# Altium schematic sheet Sheet_Pedal.schdoc
size 434 x 399 mm
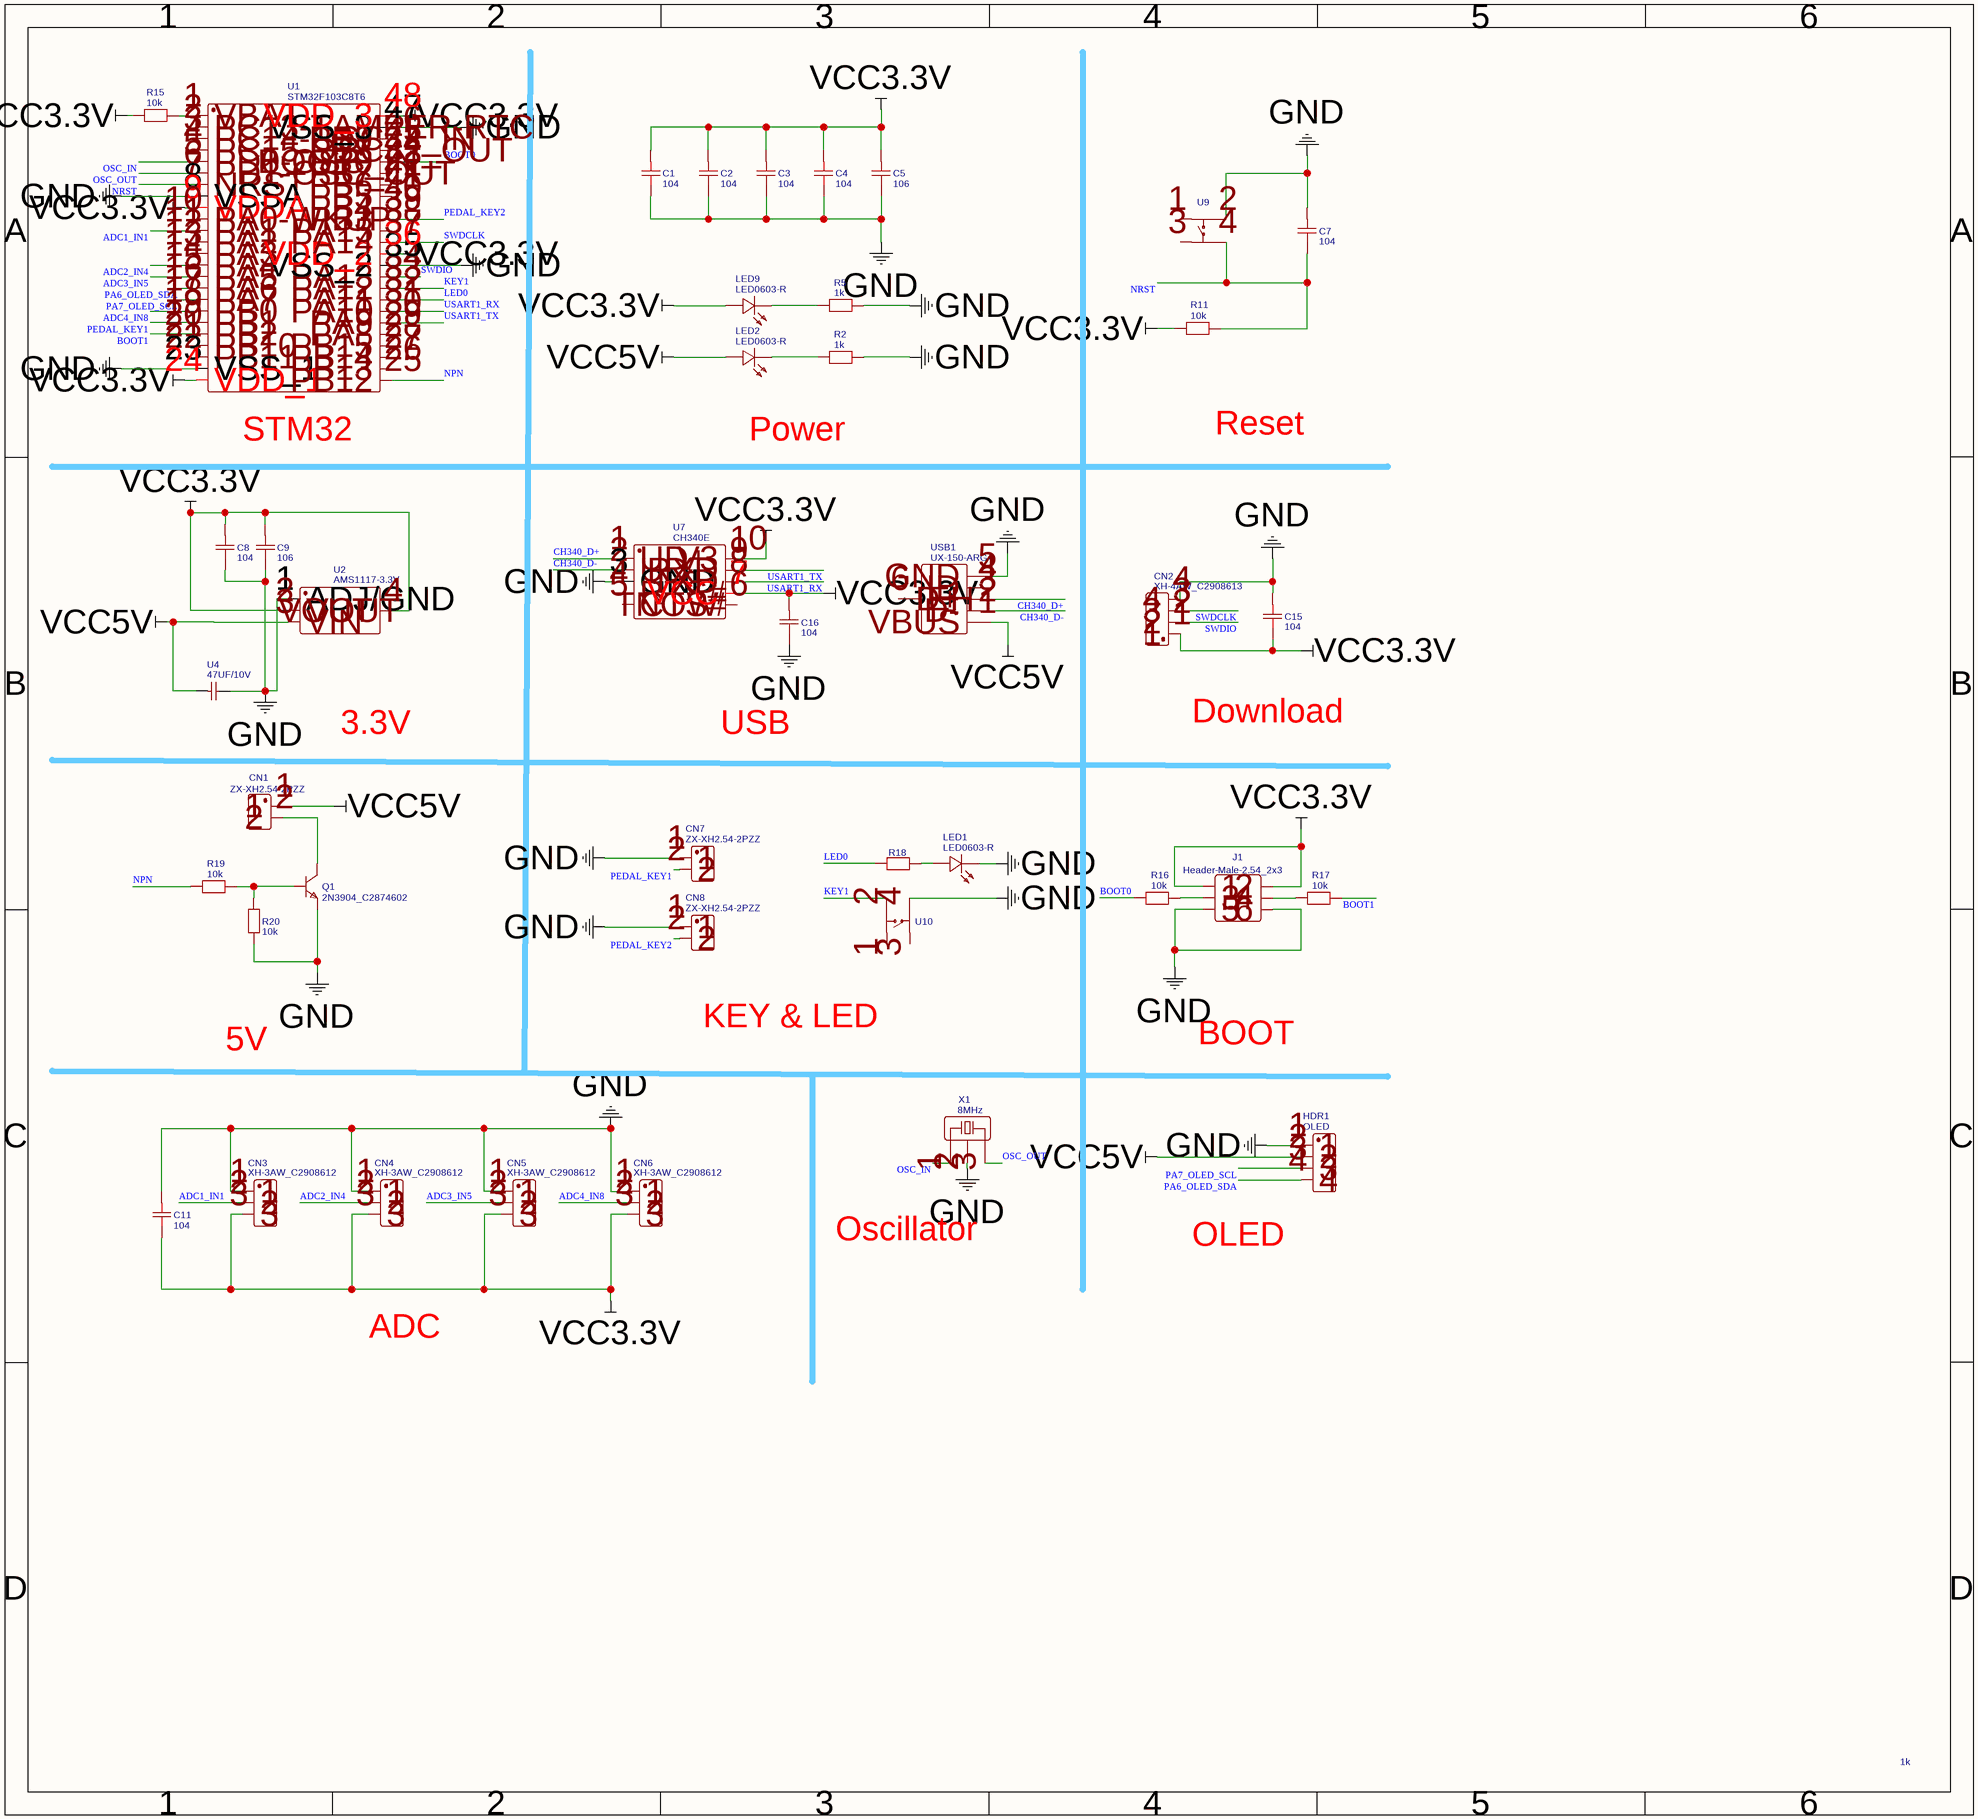
[diagram p0: Sheet_Pedal.schdoc]

## Parts
C1  104  [C0603]
C2  104  [C0603]
C3  104  [C0603]
C4  104  [C0603]
C5  106  [C0603]
C7  104  [C0603]
C8  104  [C0603]
C9  106  [C0603]
C11  104  [C0603]
C15  104  [C0603]
C16  104  [C0603]
CN1  ZX-XH2.54-2PZZ  [CONN-TH_2P-P2.50_HX25003-2A]
CN2  XH-4AW_C2908613  [CONN-TH_XH-4AW]
CN3  XH-3AW_C2908612  [CONN-TH_3P-P2.54_HCTL_XH-3AW]
CN4  XH-3AW_C2908612  [CONN-TH_3P-P2.54_HCTL_XH-3AW]
CN5  XH-3AW_C2908612  [CONN-TH_3P-P2.54_HCTL_XH-3AW]
CN6  XH-3AW_C2908612  [CONN-TH_3P-P2.54_HCTL_XH-3AW]
CN7  ZX-XH2.54-2PZZ  [CONN-TH_2P-P2.50_HX25003-2A]
CN8  ZX-XH2.54-2PZZ  [CONN-TH_2P-P2.50_HX25003-2A]
HDR1  OLED  [HDR-TH_4P-P2.54-V-M]
J1  Header-Male-2.54_2x3  [HDR-TH_6P-P2.54-V-M-R2-C3-S2.54-1]
LED1  LED0603-R  [LED0603-R-RD]
LED2  LED0603-R  [LED0603-R-RD]
LED9  LED0603-R  [LED0603-R-RD]
Q1  2N3904_C2874602  [TO-92-3_L4.6-W3.6-P1.30-L_2N3904]
R2  1k  [R0603]
R5  1k  [R0603]
R11  10k  [R0603]
R15  10k  [R0603]
R16  10k  [R0603]
R17  10k  [R0603]
R18  1k  [R0603]
R19  10k  [R0603]
R20  10k  [R0603]
U1  STM32F103C8T6  [LQFP-48_L7.0-W7.0-P0.50-LS9.0-BL]
U2  AMS1117-3.3V  [SOT-223-4_L6.5-W3.5-P2.30-LS7.0-BR]
U4  47UF/10V  [C1206]
U7  CH340E  [MSOP-10_L3.0-W3.0-P0.50-LS5.0-BL]
U9  TPS645-5NC60  [SW-SMD_4P-L6.0-W6.0-P4.50-LS9.2]  (value not drawn)
U10  TPS645-5NC60  [SW-SMD_4P-L6.0-W6.0-P4.50-LS9.2]  (value not drawn)
USB1  UX-150-ARG4  [MICRO-USB-TH_UX-150-ARG4]
X1  8MHz  [OSC-SMD_3P-L3.2-W1.3-P1.2-L]

## Nets
GND: C1.1 C2.1 C3.1 C4.1 C5.1 C7.2 C8.1 C9.1 C11.2 C15.2 C16.1 CN2.4 CN3.1 CN4.1 CN5.1 CN6.1 CN7.1 CN8.1 HDR1.1 J1.5 J1.6 LED1.2(K) Q1.1(E) R2.2 R5.2 R20.1 U1.8(VSSA) U1.23(VSS_1) U1.35(VSS_2) U1.47(VSS_3) U2.1(ADJ/GND) U4.2 U7.3(GND) U9.2 U10.4 USB1.5(GND) X1.2
VCC3.3V: C1.2 C2.2 C3.2 C4.2 C5.2 C8.2 C9.2 C11.1 C15.1 C16.2 CN2.1 CN3.3 CN4.3 CN5.3 CN6.3 J1.1 J1.2 LED9.1(A) R11.1 R15.2 U1.9(VDDA) U1.24(VDD_1) U1.36(VDD_2) U1.48(VDD_3) U2.2(VOUT) U2.4(VOUT) U7.7(VCC) U7.10(V3)
VCC5V: CN1.1 HDR1.2 LED2.1(A) U2.3(VIN) U4.1 USB1.1(VBUS)
ADC1_IN1: CN3.2 U1.11(PA1)
ADC2_IN4: CN4.2 U1.14(PA4)
ADC3_IN5: CN5.2 U1.15(PA5)
ADC4_IN8: CN6.2 U1.18(PB0)
BOOT0: R16.1 U1.44(BOOT0)
BOOT1: R17.2 U1.20(PB2)
CH340_D+: U7.1(UD+) USB1.3(D+)
CH340_D-: U7.2(UD-) USB1.2(D-)
KEY1: U1.33(PA12) U10.2
LED0: R18.1 U1.32(PA11)
NPN: R19.1 U1.25(PB12)
NRST: C7.1 R11.2 U1.7(NRST) U9.4
OSC_IN: U1.5(PD0-OSC_IN) X1.1
OSC_OUT: U1.6(PD1-OSC_OUT) X1.3
PA6_OLED_SDA: HDR1.4 U1.16(PA6)
PA7_OLED_SCL: HDR1.3 U1.17(PA7)
PEDAL_KEY1: CN7.2 U1.19(PB1)
PEDAL_KEY2: CN8.2 U1.39(PB3)
SWDCLK: CN2.3 U1.37(PA14)
SWDIO: CN2.2 U1.34(PA13)
USART1_RX: U1.31(PA10) U7.8(TXD)
USART1_TX: U1.30(PA9) U7.9(RXD)
NetCN1_2: CN1.2 Q1.3(C)
NetJ1_3: J1.3 R16.2
NetJ1_4: J1.4 R17.1
NetLED1_1: LED1.1(A) R18.2
NetLED2_2: LED2.2(K) R2.1
NetLED9_2: LED9.2(K) R5.1
NetQ1_2: Q1.2(B) R19.2 R20.2
NetR15_1: R15.1 U1.1(VBAT)

Not connected (* = marked no-connect by the designer): U1 2(PC13-TAMPER-RTC) 3(PC14-OSC32_IN) 4(PC15-OSC32_OUT) 10(PA0-WKUP) 12(PA2) 13(PA3) 21(PB10) 22(PB11) 26(PB13) 27(PB14) 28(PB15) 29(PA8) 38(PA15) 40(PB4) 41(PB5) 42(PB6) 43(PB7) 45(PB8) 46(PB9); U7 4(RTS#) 5(CTS#) 6(TNOW); U9 1 3; U10 1 3; USB1 4(ID) 6(EH)

## Notes on the sheet
- (near U1) STM32
- Power
- Reset
- 3.3V
- USB
- Download
- KEY & LED
- 5V
- BOOT
- Oscillator
- OLED
- ADC

## Library data of the parts
C1-C4 C7 C8 C11 C15 C16 = 104: nameAlias: Value(F); Contributor: LCEDA_Lib; spicePre: C; spiceSymbolName: C_0603_US
C5 C9 = 106: nameAlias: Value(F); Contributor: LCEDA_Lib; spicePre: C; spiceSymbolName: C_0603_US
CN1 CN7 CN8 = ZX-XH2.54-2PZZ: Manufacturer: Megastar(兆星); Contributor: lcsc; Supplier: LCSC; Supplier Part: C7429632; Manufacturer Part: ZX-XH2.54-2PZZ; JLCPCB Part Class: Extended Part; spicePre: C; spiceSymbolName: ZX-XH2.54-2PZZ
CN2 = XH-4AW_C2908613: Manufacturer: HCTL(华灿天禄); Manufacturer Part: XH-4AW; Contributor: LCSC; Supplier: LCSC; Supplier Part: C2908613; JLCPCB Part Class: Extended Part; spicePre: C; spiceSymbolName: XH-4AW_C2908613
CN3-CN6 = XH-3AW_C2908612: Manufacturer: HCTL(华灿天禄); Manufacturer Part: XH-3AW; Contributor: LCSC; Supplier: LCSC; Supplier Part: C2908612; JLCPCB Part Class: Extended Part; spicePre: C; spiceSymbolName: XH-3AW_C2908612
HDR1 = OLED: Manufacturer: null; Contributor: lcsc; Supplier: LCSC; Supplier Part: C9900026893; JLCPCB Part Class: Extended Part; spicePre: H; spiceSymbolName: 2.5-4PIN
J1 = Header-Male-2.54_2x3: Manufacturer: BOOMELE(博穆精密); Manufacturer Part: 2.54-2*3P针; Supplier: LCSC; Supplier Part: C65114; JLCPCB Part Class: Extended Part; spicePre: J; spiceSymbolName: Header-Male-2.54_2x3
LED1 LED2 LED9 = LED0603-R: Manufacturer: null; Contributor: LCSC; Supplier: LCSC; Supplier Part: C9900005326; Manufacturer Part: LED0603-R; JLCPCB Part Class: Extended Part; spicePre: L; spiceSymbolName: LED0603-R
Q1 = 2N3904_C2874602: Manufacturer: JSMSEMI(杰盛微); Manufacturer Part: 2N3904; Contributor: LCSC; Supplier: LCSC; Supplier Part: C2874602; JLCPCB Part Class: Extended Part; spicePre: Q; spiceSymbolName: 2N3904_C2874602
R2 R5 R18 = 1k: nameAlias: Value(Ω); Contributor: LCEDA_Lib; spicePre: R; spiceSymbolName: R_0603_EU
R11 R15-R17 R19 R20 = 10k: nameAlias: Value(Ω); Contributor: LCEDA_Lib; spicePre: R; spiceSymbolName: R_0603_EU
U1 = STM32F103C8T6: Manufacturer: ST(意法半导体); timeStamp: 1455028086; Supplier: LCSC; Manufacturer Part: STM32F103C8T6; Supplier Part: C8734; JLCPCB Part Class: Extended Part; spicePre: U; spiceSymbolName: STM32F103C8T6
U2 = AMS1117-3.3V: Manufacturer: WPMtek(维攀微); Contributor: LCSC; Supplier: LCSC; Supplier Part: C2688239; Manufacturer Part: AMS1117-3.3V; JLCPCB Part Class: Extended Part; spicePre: U; spiceSymbolName: AMS1117-3.3V
U4 = 47UF/10V: Manufacturer: null; Contributor: LCSC; Supplier: LCSC; Supplier Part: C9900008467; Manufacturer Part: 47uF/10V; link: https://atta.szlcsc.comnull; JLCPCB Part Class: Extended Part; spicePre: U; spiceSymbolName: 47UF/10V_C9900008467
U7 = CH340E: Manufacturer: WCH(南京沁恒); Supplier: LCSC; Manufacturer Part: CH340E; Supplier Part: C99652; JLCPCB Part Class: Extended Part; spicePre: U; spiceSymbolName: CH340E
U9 U10 = TPS645-5NC60: Manufacturer: ROCPU Switches(台普); Contributor: lcsc; Supplier: LCSC; Supplier Part: C19191552; Manufacturer Part: TPS645-5NC60; JLCPCB Part Class: Extended Part; spicePre: U; spiceSymbolName: TPS645-5NC60
USB1 = UX-150-ARG4: Manufacturer: XUNPU(讯普); Contributor: LCSC; Supplier: LCSC; Supplier Part: C720612; Manufacturer Part: UX-150-ARG4; JLCPCB Part Class: Extended Part; spicePre: U; spiceSymbolName: UX-150-ARG4
X1 = 8MHz: Manufacturer Part: CSTCE8M00G52-R0; Manufacturer: muRata(村田); nameAlias: Frequency; Supplier: LCSC; Supplier Part: C22549; JLCPCB Part Class: Extended Part; spicePre: X; spiceSymbolName: CSTCE8M00G52-R0